# Altium schematic sheet UNG_8088_EVB_LAN9252-SPI_LAN9252-1.SchDoc
size 416 x 264 mm; Revision: A0; SheetNumber: 2; SheetTotal: 4; PageSetup: Record=PageOptions|CenterHorizontal=True|CenterVertical=True|PrintScale=1.02|XCorrection=1.00|YCorrection=1.00|PrintKind=0|BorderSize=5000000|LeftOffset=0|BottomOffset=0|Orientation=2|PaperLength=1000|PaperWidth=1000|Scale=100|PaperSource=15|PrintQuality=-3|MediaType=1|DitherType=10|PrintScaleMode=1|PaperKind=11 x 17|PaperIndex=119; SheetTitle: Change Log; PageTitle: LAN9252-1; ProjName: JUTLAND; DesignDescription: EVB_LAN9252-SPI; Designer: Manikandan; PartNumber: UNG_8088; DocumentFullPathAndName: //depot_np_hweng_boards/ung_hweng/UNG_8088_FDB_LAN9252-ADD-ON-forF28379D/
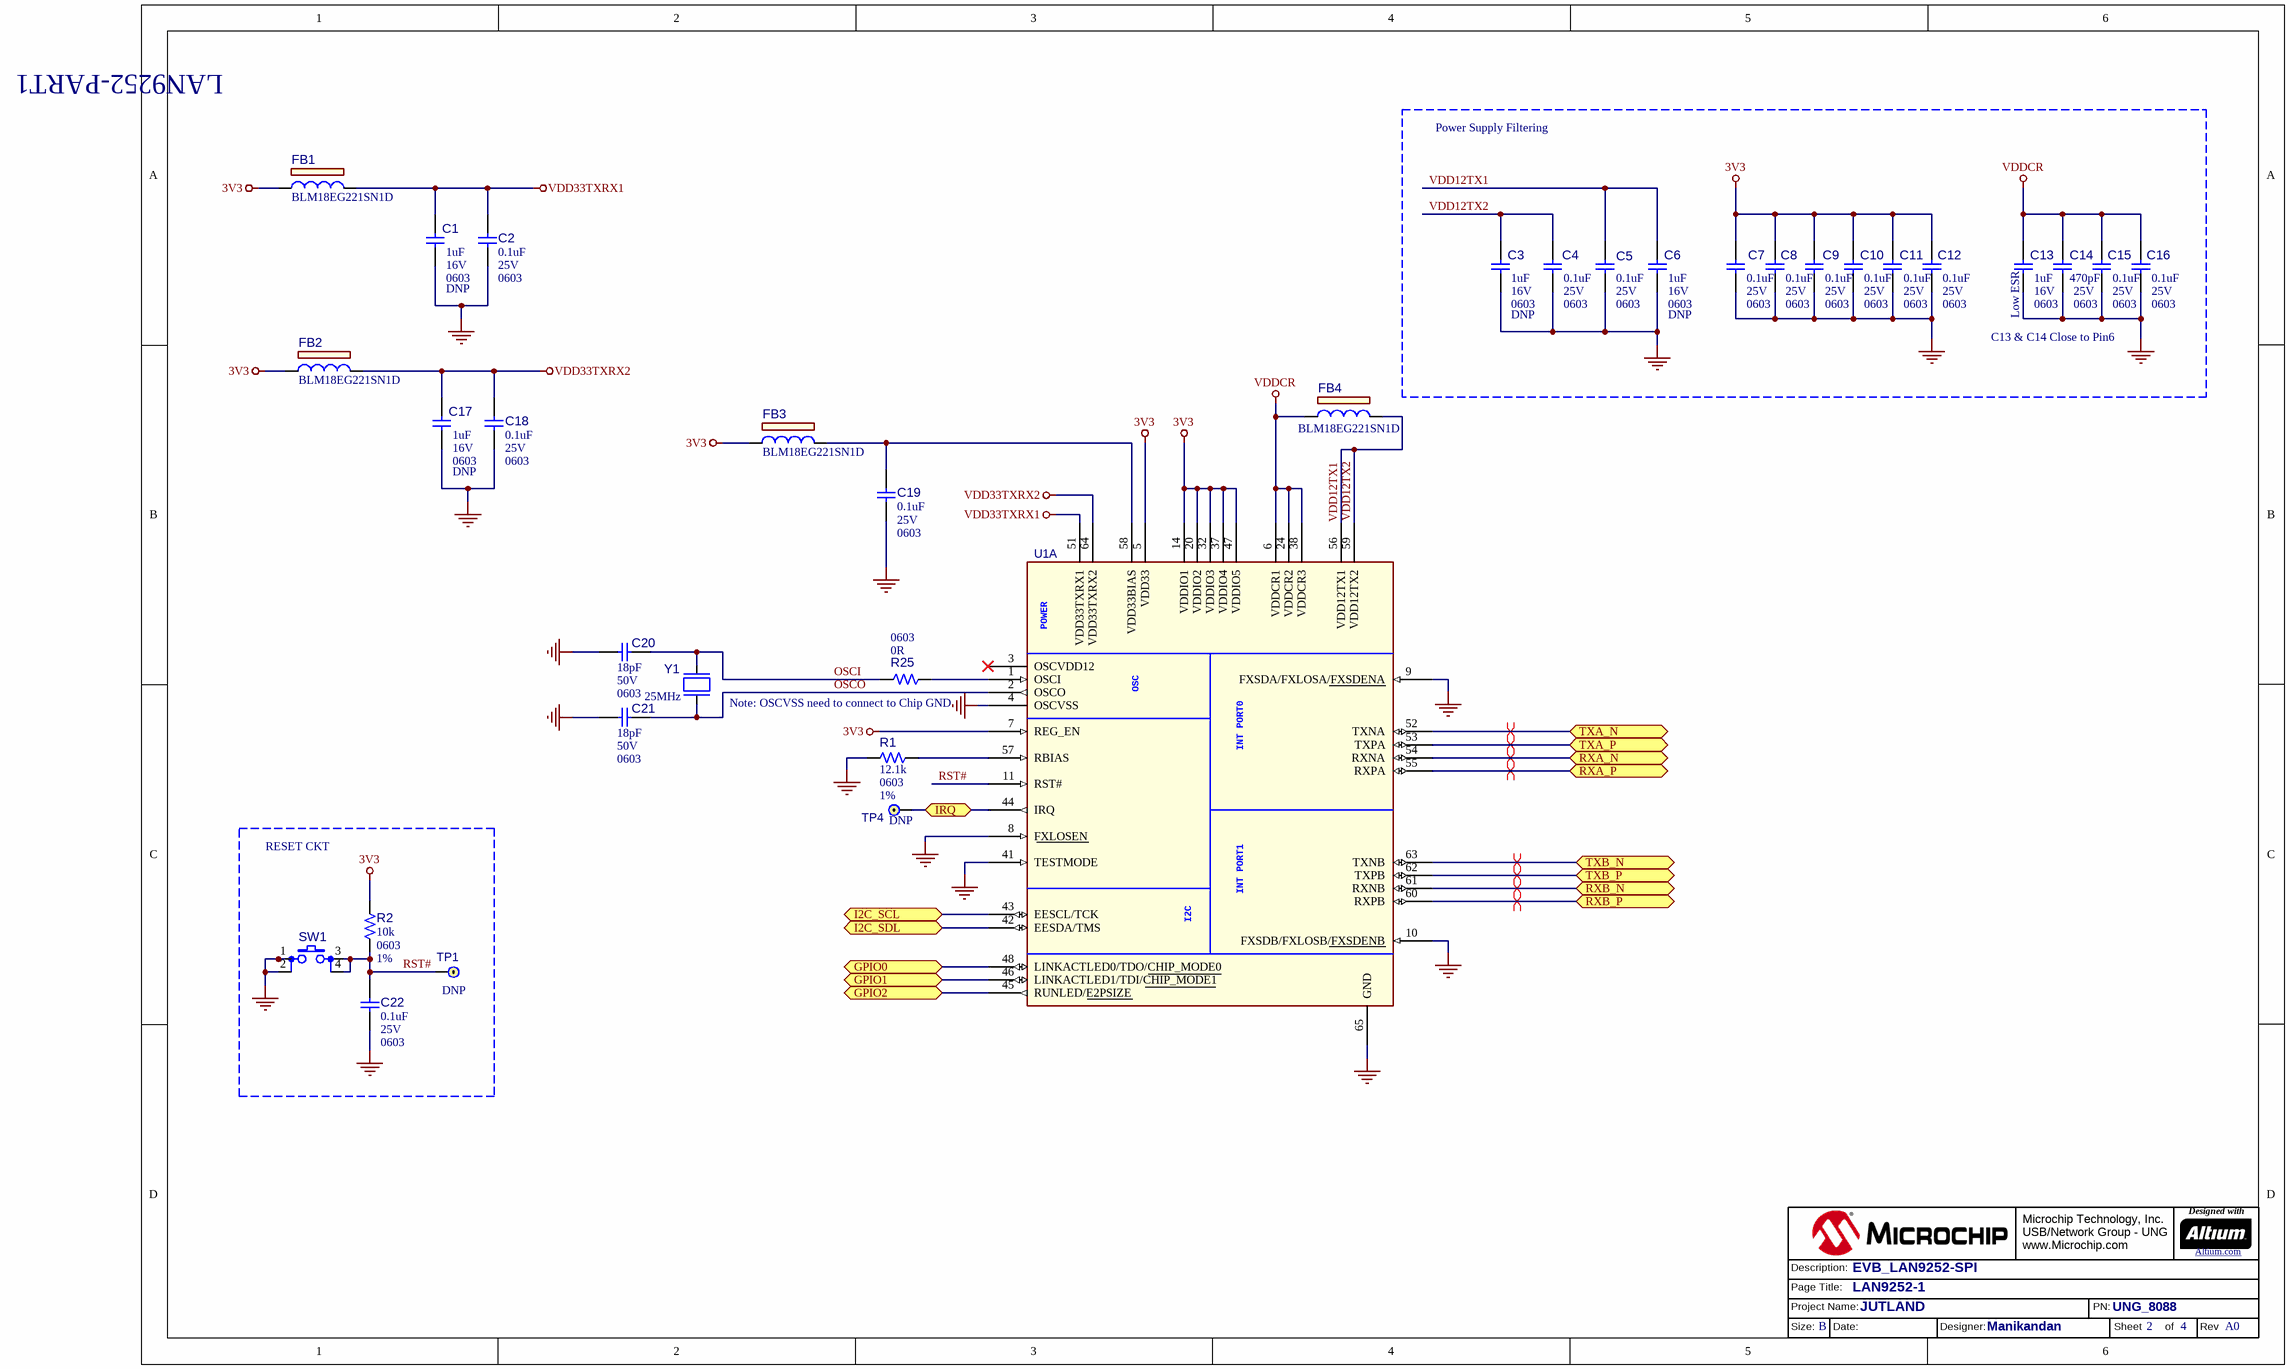
[diagram p0: UNG_8088_EVB_LAN9252-SPI_LAN9252-1.SchDoc]

## Parts
?  (no value)  (graphical)
C1  value 1uF  Voltage: 16V  Package: 0603  Populated: DNP  [CAP_C_0603]  (hidden comment: Capacitor NP)
C2  value 0.1uF  Voltage: 25V  Package: 0603  [CAP_C_0603]  (hidden comment: Capacitor NP)
C3  value 1uF  Voltage: 16V  Package: 0603  Populated: DNP  [CAP_C_0603]  (hidden comment: Capacitor NP)
C4  value 0.1uF  Voltage: 25V  Package: 0603  [CAP_C_0603]  (hidden comment: Capacitor NP)
C5  value 0.1uF  Voltage: 25V  Package: 0603  [CAP_C_0603]  (hidden comment: Capacitor NP)
C6  value 1uF  Voltage: 16V  Package: 0603  Populated: DNP  [CAP_C_0603]  (hidden comment: Capacitor NP)
C7  value 0.1uF  Voltage: 25V  Package: 0603  [CAP_C_0603]  (hidden comment: Capacitor NP)
C8  value 0.1uF  Voltage: 25V  Package: 0603  [CAP_C_0603]  (hidden comment: Capacitor NP)
C9  value 0.1uF  Voltage: 25V  Package: 0603  [CAP_C_0603]  (hidden comment: Capacitor NP)
C10  value 0.1uF  Voltage: 25V  Package: 0603  [CAP_C_0603]  (hidden comment: Capacitor NP)
C11  value 0.1uF  Voltage: 25V  Package: 0603  [CAP_C_0603]  (hidden comment: Capacitor NP)
C12  value 0.1uF  Voltage: 25V  Package: 0603  [CAP_C_0603]  (hidden comment: Capacitor NP)
C13  value 1uF  Voltage: 16V  Package: 0603  [CAP_C_0603]  (hidden comment: Capacitor NP)
C14  value 470pF  Voltage: 25V  Package: 0603  [CAP_C_0603]  (hidden comment: Capacitor NP)
C15  value 0.1uF  Voltage: 25V  Package: 0603  [CAP_C_0603]  (hidden comment: Capacitor NP)
C16  value 0.1uF  Voltage: 25V  Package: 0603  [CAP_C_0603]  (hidden comment: Capacitor NP)
C17  value 1uF  Voltage: 16V  Package: 0603  Populated: DNP  [CAP_C_0603]  (hidden comment: Capacitor NP)
C18  value 0.1uF  Voltage: 25V  Package: 0603  [CAP_C_0603]  (hidden comment: Capacitor NP)
C19  value 0.1uF  Voltage: 25V  Package: 0603  [CAP_C_0603]  (hidden comment: Capacitor NP)
C20  value 18pF  Voltage: 50V  Package: 0603  [CAP_C_0603]  (hidden comment: Capacitor NP)
C21  value 18pF  Voltage: 50V  Package: 0603  [CAP_C_0603]  (hidden comment: Capacitor NP)
C22  value 0.1uF  Voltage: 25V  Package: 0603  [CAP_C_0603]  (hidden comment: Capacitor NP)
FB1  value BLM18EG221SN1D  [SMD_0603]  (hidden comment: FERRITE BLM18EG221SN1D)
FB2  value BLM18EG221SN1D  [SMD_0603]  (hidden comment: FERRITE BLM18EG221SN1D)
FB3  value BLM18EG221SN1D  [SMD_0603]  (hidden comment: FERRITE BLM18EG221SN1D)
FB4  value BLM18EG221SN1D  [SMD_0603]  (hidden comment: FERRITE BLM18EG221SN1D)
R1  value 12.1k  Package: 0603  Tolerance: 1%  [RES_C_0603]  (hidden comment: Resistor)
R2  value 10k  Package: 0603  Tolerance: 1%  [RES_C_0603]  (hidden comment: Resistor)
R25  value 0R  Package: 0603  [RES_C_0603]  (hidden comment: Resistor)
SW1  Switch TACT 4 Pin PTS810  [SW_MOM_4M2X3M2]  (value not drawn)
TP1  Populated: DNP  [TP_PAD51D36]  (hidden comment: Jumper)  (no BOM)
TP4  Populated: DNP  [TP_PAD51D36]  (hidden comment: Jumper)  (no BOM)
U1  (no value)  [QFN-64_9x9_EP6SQ]  (part A of 2)
Y1  Frequency: 25MHz  [CRYSTAL_HC49-SMD-B]  (hidden comment: XTAL 25MHz HC49/US)

## Blocks framed on the sheet
RESET CKT: C22 R2 SW1 TP1

## Ports
GPIO0 (bidir), GPIO1 (bidir), GPIO2 (bidir), I2C_SCL (bidir), I2C_SDL (bidir), IRQ (bidir), RXA_N (bidir), RXA_P (bidir), RXB_N (bidir), RXB_P (bidir), TXA_N (bidir), TXA_P (bidir), TXB_N (bidir), TXB_P (bidir)

## Nets
3V3: C7.2 C8.2 C9.2 C10.2 C11.2 C12.2 FB1.1 FB2.1 FB3.1 R2.2 U1.5(VDD33) U1.7(REG_EN) U1.14(VDDIO1) U1.20(VDDIO2) U1.32(VDDIO3) U1.37(VDDIO4) U1.47(VDDIO5)
GND: C1.1 C2.1 C3.1 C4.1 C5.1 C6.1 C7.1 C8.1 C9.1 C10.1 C11.1 C12.1 C13.1 C14.1 C15.1 C16.1 C17.1 C18.1 C19.1 C20.1 C21.1 C22.1 R1.1 SW1.1 SW1.2 U1.4(OSCVSS) U1.8(FXLOSEN) U1.9(FXSDA/FXLOSA/FXSDENA) U1.10(FXSDB/FXLOSB/FXSDENB) U1.41(TESTMODE) U1.65(GND)
VDD33TXRX1: C1.2 C2.2 FB1.2 U1.51(VDD33TXRX1)
VDD33TXRX2: C17.2 C18.2 FB2.2 U1.64(VDD33TXRX2)
VDDCR: C13.2 C14.2 C15.2 C16.2 FB4.1 U1.6(VDDCR1) U1.24(VDDCR2) U1.38(VDDCR3)
GPIO0: U1.48(LINKACTLED0/TDO/CHIP_MODE0) ; port GPIO0
GPIO1: U1.46(LINKACTLED1/TDI/CHIP_MODE1) ; port GPIO1
GPIO2: U1.45(RUNLED/E2PSIZE) ; port GPIO2
I2C_SCL: U1.43(EESCL/TCK) ; port I2C_SCL
I2C_SDL: U1.42(EESDA/TMS) ; port I2C_SDL
IRQ: TP4.1(P1) U1.44(IRQ) ; port IRQ
OSCI: C20.2 R25.1 Y1.2(Osc2)
OSCO: C21.2 U1.2(OSCO) Y1.1(Osc1)
RST#: C22.2 R2.1 SW1.3 SW1.4 TP1.1(P1) U1.11(RST#)
RXA_N: U1.54(RXNA) ; port RXA_N
RXA_P: U1.55(RXPA) ; port RXA_P
RXB_N: U1.61(RXNB) ; port RXB_N
RXB_P: U1.60(RXPB) ; port RXB_P
TXA_N: U1.52(TXNA) ; port TXA_N
TXA_P: U1.53(TXPA) ; port TXA_P
TXB_N: U1.63(TXNB) ; port TXB_N
TXB_P: U1.62(TXPB) ; port TXB_P
VDD12TX1: C3.2 C4.2 C5.2 C6.2 FB4.2 U1.56(VDD12TX1) U1.59(VDD12TX2)  [also labelled VDD12TX2]
NetC19_2: C19.2 FB3.2 U1.58(VDD33BIAS)
NetR1_2: R1.2 U1.57(RBIAS)
NetR25_2: R25.2 U1.1(OSCI)

Not connected (* = marked no-connect by the designer): U1 3(OSCVDD12)*

## Layout directives
differential pair: RXA_N, RXA_P, RXB_N, RXB_P, TXA_N, TXA_P, TXB_N, TXB_P

## Notes on the sheet
- LAN9252-PART1
- Power Supply Filtering
- C13 & C14 Close to Pin6
- (near C13) Low ESR
- (near R25) Note: OSCVSS need to connect to Chip GND
- Microchip Technology, Inc.
  USB/Network Group - UNG
  www.Microchip.com
- Designed with
- Altium.com <http://go.altium.com/MicrochipLandingPage_Evaluation.html>
- Page Title:
- Project Name:
- Description:
- PN:
- Size:
- B
- Date:
- Designer:
- Sheet
- of
- Rev
- (in symbol LAN9252_QFN64, part A) POWER; OSC; INT PORT0; INT PORT1; I2C

## Library data of the parts
? = Title Block B_UNG1_Altium
C1 C3 C6 C17 = CAP0265: Capacitor; Manufacturer 1: AVX; Manufacturer Part Number 1: 0603YD105KAT2A; Description_: CAP CER 1uF 16V 10% X5R SMD 0603; Tolerance: 10%; Temperature Coeffcient: X5R; Type: Ceramic; MCHP-ID: CAP0265; Revision: 1; Status: Production; ComponentLink1URL: https://chn-vm-apps.microchip.com/mchprepo/parts/Datasheets/smccp.pdf; ComponentLink1Description: Datasheet; Operating Temperature: -55C to +85C; Category: Capacitor; Manufacturer 2: Murata; Manufacturer Part Number 2: GRM188R61C105KA93D; Manufacturer 3: Murata; Manufacturer Part Number 3: GRM185R61C105KE44D; Manufacturer 4: Panasonic; Manufacturer Part Number 4: ECJ-1VB1C105K; Manufacturer 5: Taiyo Yuden; Manufacturer Part Number 5: EMK107BJ105KA-T; Manufacturer 6: TDK; Manufacturer Part Number 6: C1608X5R1C105K; Supplier 1: Digi-Key; Supplier Part Number 1: 478-1249-1-ND; Supplier 2: Digi-Key; Supplier Part Number 2: 490-1536-1-ND; Supplier 3: Digi-Key; Supplier Part Number 3: 490-3894-1-ND; Supplier 4: Digi-Key; Supplier Part Number 4: PCC2224CT-ND; Supplier 5: Digi-Key; Supplier Part Number 5: 587-1251-1-ND; Supplier 6: Digi-Key; Supplier Part Number 6: 445-1416-1-ND; Quantity Override: 1
C2 C4 C5 C7-C12 C15 C16 C18 C19 C22 = CAP0012: Capacitor; Manufacturer 1: Cal-Chip; Manufacturer Part Number 1: GMC10Y5V104Z25NTLF; Description_: CAP CER 0.1uF 25V 20% Y5V SMD 0603; Tolerance: 20%; Temperature Coeffcient: Y5V; Type: Ceramic; Populated: Yes; MCHP-ID: CAP0012; Revision: 1; Status: Production; ComponentLink1URL: https://chn-vm-apps.microchip.com/mchprepo/parts/Datasheets/nmc2.pdf; ComponentLink1Description: Datasheet; Operating Temperature: -30C to + 85C; Category: Capacitor; Manufacturer 2: NIC Components; Manufacturer Part Number 2: NMC0603Y5V104Z25TRPF; Manufacturer 3: Panasonic; Manufacturer Part Number 3: ECJ-1VF1E104Z; Manufacturer 4: ROHM; Manufacturer Part Number 4: MCH182FN104ZK; Manufacturer 5: Murata; Manufacturer Part Number 5: GRM188F51E104ZA01D; Supplier 1: Cal-Chip; Supplier Part Number 1: GMC10Y5V104Z25NTLF; Supplier 2: NIC Components; Supplier Part Number 2: NMC0603Y5V104Z25TRPF; Supplier 3: Digi-Key; Supplier Part Number 3: PCC1794TR-ND; Supplier 4: ROHM; Supplier Part Number 4: MCH182FN104ZK; Supplier 5: Raynen; Supplier Part Number 5: 490-1575-1-ND; Quantity Override: 1
C13 = CAP0265: Capacitor; Manufacturer 1: AVX; Manufacturer Part Number 1: 0603YD105KAT2A; Description_: CAP CER 1uF 16V 10% X5R SMD 0603; Tolerance: 10%; Temperature Coeffcient: X5R; Type: Ceramic; Populated: Yes; MCHP-ID: CAP0265; Revision: 1; Status: Production; ComponentLink1URL: https://chn-vm-apps.microchip.com/mchprepo/parts/Datasheets/smccp.pdf; ComponentLink1Description: Datasheet; Operating Temperature: -55C to +85C; Category: Capacitor; Manufacturer 2: Murata; Manufacturer Part Number 2: GRM188R61C105KA93D; Manufacturer 3: Murata; Manufacturer Part Number 3: GRM185R61C105KE44D; Manufacturer 4: Panasonic; Manufacturer Part Number 4: ECJ-1VB1C105K; Manufacturer 5: Taiyo Yuden; Manufacturer Part Number 5: EMK107BJ105KA-T; Manufacturer 6: TDK; Manufacturer Part Number 6: C1608X5R1C105K; Supplier 1: Digi-Key; Supplier Part Number 1: 478-1249-1-ND; Supplier 2: Digi-Key; Supplier Part Number 2: 490-1536-1-ND; Supplier 3: Digi-Key; Supplier Part Number 3: 490-3894-1-ND; Supplier 4: Digi-Key; Supplier Part Number 4: PCC2224CT-ND; Supplier 5: Digi-Key; Supplier Part Number 5: 587-1251-1-ND; Supplier 6: Digi-Key; Supplier Part Number 6: 445-1416-1-ND; Quantity Override: 1
C14 = CAP0603: Capacitor; Manufacturer 1: AVX; Manufacturer Part Number 1: 06033A471JAT2A; Description_: CAP CER 470pF 25V 5% NP0 SMD 0603; Tolerance: 5%; Temperature Coeffcient: NP0; Type: Ceramic; Populated: Yes; MCHP-ID: CAP0603; Revision: 1; Status: Production; ComponentLink1URL: https://chn-vm-apps.microchip.com/mchprepo/parts/Datasheets/smccp.pdf; ComponentLink1Description: Datasheet; Operating Temperature: -55C to +125C; Category: Capacitor; Supplier 1: Digi-Key; Supplier Part Number 1: 478-6201-1-ND; Quantity Override: 1
C20 C21 = CAP0063: Capacitor; Manufacturer 1: KEMET; Manufacturer Part Number 1: C0603C180J5GACTU; Description_: CAP CER 18pF 50V 5% NP0 SMD 0603; Tolerance: 5%; Temperature Coeffcient: NP0; Type: Ceramic; Populated: Yes; MCHP-ID: CAP0063; Revision: 1; Status: Production; ComponentLink1URL: https://chn-vm-apps.microchip.com/mchprepo/parts/Datasheets/ECJ__General_.pdf; ComponentLink1Description: Datasheet; Operating Temperature: -55C to +125C; Category: Capacitor; Manufacturer 2: TDK; Manufacturer Part Number 2: C1608C0G1H180J; Manufacturer 3: Murata; Manufacturer Part Number 3: GRM1885C1H180JA01D; Manufacturer 4: Panasonic; Manufacturer Part Number 4: ECJ-1VC1H180J; Supplier 1: Digi-Key; Supplier Part Number 1: 399-1052-1-ND; Supplier 2: Digi-Key; Supplier Part Number 2: 445-1272-1-ND; Supplier 3: Digi-Key; Supplier Part Number 3: 490-1409-1-ND; Supplier 4: Digi-Key; Supplier Part Number 4: PCC180ACVCT-ND; Quantity Override: 1
FB1-FB4 = FERRITE BLM18EG221SN1D: FERRITE BEAD 2A 220OHM 0603; Manufacturer 1: Murata Electronics North America; Owner: Manikandan; DCR: 50ohm; Populated: YES; Symbol: Ferrite Bead; Description_: FERRITE BEAD 2A 220OHM 0603; ComponentLink1URL: http://search.murata.co.jp/Ceramy/image/img/PDF/ENG/L0110S0101BLM18E.pdf; ComponentLink1Description: Datasheet; Operating Temperature: -55C to +125C; Package: 0603; Type: Ferrite Bead; Category: Ferrite Bead; Manufacturer Part Number 1: BLM18EG221SN1D; Supplier 1: Digi-Key; Supplier Part Number 1: 490-3992-1-ND; Quantity Override: 1
R1 = RSMT0414: Manufacturer 1: Panasonic; Manufacturer Part Number 1: ERJ-3EKF1212V; Description_: RES TKF 12.1k 1% 1/10W SMD 0603; Voltage: 75V; Temperature Coeffcient: 100ppm/C; Power: 1/10W; Populated: Yes; MCHP-ID: RSMT0414; Revision: 1; Status: Production; ComponentLink1URL: https://chn-vm-apps.microchip.com/mchprepo/parts/Datasheets/AOA0000CE2.pdf; ComponentLink1Description: Datasheet; Operating Temperature: -55C to +155C; Category: Resistor; Type: RES SMD; Composition: TKF; Manufacturer 2: ROHM; Manufacturer Part Number 2: MCR03EZPFX1212; Manufacturer 3: SET; Manufacturer Part Number 3: RMCF1/1612.1K1%TR; Supplier 1: Digi-Key; Supplier Part Number 1: P12.1KHCT-ND; Supplier 2: Digi-Key; Supplier Part Number 2: RHM12.1KHCT-ND; Supplier 3: SET; Supplier Part Number 3: RMCF1/1612.1K1%TR; Quantity Override: 1
R2 = RES1368: Manufacturer 1: TE Connectivity; Manufacturer Part Number 1: 5-1879337-9; Description_: RES TF 10k 1% 1/16W SMD 0603; Voltage: 100V; Temperature Coeffcient: 50ppm/C; Circuit Type: Isolated; Power: 1/16W; Owner: Jairuz Agang-ang; Populated: YES; MCHP-ID: RES1368; Revision: 1; Status: Production; ComponentLink1URL: https://chn-vm-apps.microchip.com/mchprepo/parts/Datasheets/ENG_DS_1773200_H.pdf; ComponentLink1Description: Datasheet; Operating Temperature: -55C to +155C; Category: Resistor; Type: RES SMD; Composition: TF; Supplier 1: Digi-Key; Supplier Part Number 1: A102203CT-ND; Quantity Override: 1
R25 = RSMT0001: Manufacturer 1: NIC Components; Manufacturer Part Number 1: NRC06Z0TRF; Description_: RES TKF 0R 1/10W SMD 0603; Power: 1/10W; Populated: Yes; MCHP-ID: RSMT0001; Revision: 2; Status: Production; ComponentLink1URL: https://chn-vm-apps.microchip.com/mchprepo/parts/Datasheets/nrc.pdf; ComponentLink1Description: Datasheet; Operating Temperature: -55C to +155C; Category: Resistor; Type: RES SMD; Composition: TKF; Manufacturer 2: Panasonic; Manufacturer Part Number 2: ERJ-3GSY0R00V; Manufacturer 3: Panasonic; Manufacturer Part Number 3: ERJ-3GEY0R00V; Manufacturer 4: Stackpole Electronics Inc; Manufacturer Part Number 4: RMCF0603ZT0R00; Manufacturer 5: Vishay; Manufacturer Part Number 5: CRCW06030000Z0EA; Manufacturer 6: Stackpole Electronics Inc; Manufacturer Part Number 6: RMCF 1/16 0 R; Manufacturer 7: Yageo; Manufacturer Part Number 7: RC0603JR-070RL; Manufacturer 8: KOA Speer; Manufacturer Part Number 8: RK73Z1JTTP; Manufacturer 9: ROHM; Manufacturer Part Number 9: MCR03EZPJ000; Supplier 1: NIC Components; Supplier Part Number 1: NRC06Z0TRF; Supplier 2: Digi-Key; Supplier Part Number 2: P0.0GTR-ND; Supplier 3: Digi-Key; Supplier Part Number 3: RMCF0603ZT0R00TR-ND; Supplier 4: Digi-Key; Supplier Part Number 4: RMCF0603ZT0R00CT-ND; Supplier 5: Digi-Key; Supplier Part Number 5: 541-0.0GCT-ND; Supplier 6: Digi-Key; Supplier Part Number 6: RMCF1/160RTR-ND; Supplier 7: Digi-Key; Supplier Part Number 7: 311-0.0GRCT-ND; Supplier 8: KOA Speer; Supplier Part Number 8: RK73Z1JTTP; Supplier 9: Digi-Key; Supplier Part Number 9: RHM0.0GCT-ND; Quantity Override: 1
SW1 = Switch TACT 4 Pin PTS810: SWITCH TACTILE SPST-NO 0.05A 16V PTS810 4.2 x 3.2 mm; Manufacturer: C&K Components; Manufacturer Part Number: PTS810 SJM 250 SMTR LFS; Current: 50mA; Switch Function: Off-Mom; Contact Rating @ Voltage: 0.05A @ 16VDC; Actuator Type: Standard; Actuator Height off PCB, from Pins: 2.50mm; Actuator Orientation: Top Actuated; Outline: 4.20mm x 3.20mm; Illumination: Non-Illuminated; Operating Force: 160gf; Switch Travel: 0.15mm; Mechanical Life: 150,000 Cycles; Decription_: Switch, Tactile, SPST, 50mA, 16VDC, J-lead, 4.2 x 3.2 mm, PTS810, NO; Revision: 0; ComponentLink1URL: https://chn-vm-apps.microchip.com/mchprepo/parts/Datasheets/32997.pdf; ComponentLink1Description: Datasheet; Category: Switch; Supplier 1: Digi-Key; RoHS: RoHS Compliant; Stock 1: 21876; Pricing 1: 1=0.28, 10=0.268, 25=0.2588, 50=0.2494, 100=0.2356, 250=0.22176, 500=0.21252, 1000=0.1617 (USD); Packaging: Cut Tape (CT); Circuit: SPST-NO; Mounting Type: Surface Mount; Termination Style: J Lead; Illumination Voltage (Nominal): -; Illumination Type, Color: -; Ingress Protection: -; Features: -; Actuator Material: -; Operating Temperature: -40°C ~ 85°C; ComponentLink2URL: http://www.ck-components.com/80183/pts810_4mar13.pdf/; ComponentLink2Description: http://www.ck-components.com/80183/pts810_4mar13.pdf/; Supplier Part Number 1: CKN10502CT-ND
TP1 TP4 = TEST PAD TH 51X36: Manufacturer Part Number: none; Description_: TEST Pad, PIN sized, 51pad, 36 FHS; Manufacturer: none; Category: Non BOM Item; Type: Male; Mounting Type: Through Hole; Supplier 1: none; Supplier Part Number 1: none
U1 = LAN9252_QFN64: IC, 2/3-Port EtherCAT® Slave Controller, QFN64; Manufacturer Part Number 1: LAN9252x/ML; Manufacturer 1: Microchip; Populated: Yes; Owner: Manikandan; Supplier Part Number 1: LAN9252I/ML-ND; Supplier 1: Digikey; Description_: IC, 2/3-Port EtherCAT® Slave Controller, QFN64; RoHS: Yes; Package: QFN64-9X9x1; Document Link: http://ww1.microchip.com/downloads/en/DeviceDoc/00001909A.pdf; Status: New
Y1 = XTAL 25MHz HC49US: Crystal 25MHz HC49/US; Manufacturer: Murata Electronics North America; Frequency Stability: ±30ppm; Load Capacitance: 6pF; Operating Mode: Fundamental; Revision: A; Supplier 1: Mouser; RoHS: RoHS Compliant; Category: Crystals and Oscillators; Stock 1: 4385; Pricing 1: 1=0.52, 10=0.434, 50=0.3894, 100=0.3465, 500=0.33, 1000=0.2772 (USD); Packaging: Cut Tape (CT); Type: MHz Crystal; Frequency Tolerance: ±30ppm; Operating Temperature: -30°C ~ 85°C; Ratings: -; Mounting Type: Surface Mount; Package / Case: HC49/US